# Altium schematic sheet MOTORS.SchDoc
size A; SheetNumber: 6; SheetTotal: 12
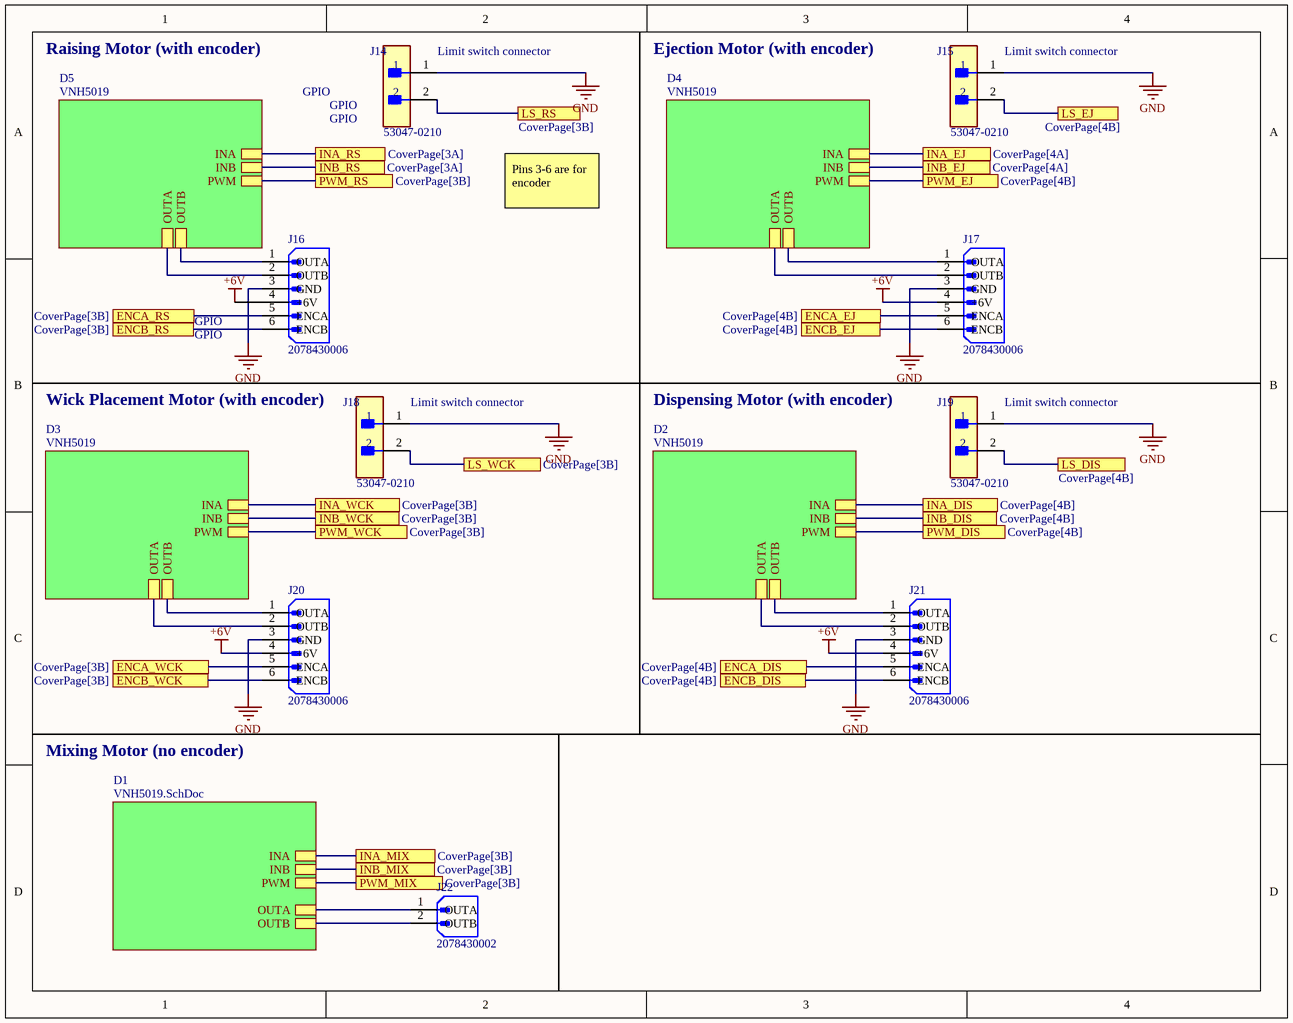
[diagram p0: MOTORS.SchDoc]

## Parts
J14  53047-0210  [FP-53047-0210-MFG]
J15  53047-0210  [FP-53047-0210-MFG]
J16  2078430006  [MOLEX_2078430006]
J17  2078430006  [MOLEX_2078430006]
J18  53047-0210  [FP-53047-0210-MFG]
J19  53047-0210  [FP-53047-0210-MFG]
J20  2078430006  [MOLEX_2078430006]
J21  2078430006  [MOLEX_2078430006]
J22  2078430002  [MOLEX_2078430002]

## Sub-sheets
D1 = VNH5019.SchDoc: INB, PWM, INA, OUTA, OUTB
D2 = VNH5019: INB, PWM, INA, OUTA, OUTB
D3 = VNH5019: INB, PWM, INA, OUTA, OUTB
D4 = VNH5019: INB, PWM, INA, OUTA, OUTB
D5 = VNH5019: OUTA, OUTB, PWM, INA, INB

## Ports
ENCA_DIS (see CoverPage[4B]), ENCA_EJ (see CoverPage[4B]), ENCA_RS (see CoverPage[3B]), ENCA_WCK (see CoverPage[3B]), ENCB_DIS (see CoverPage[4B]), ENCB_EJ (see CoverPage[4B]), ENCB_RS (see CoverPage[3B]), ENCB_WCK (see CoverPage[3B]), INA_DIS (see CoverPage[4B]), INA_EJ (see CoverPage[4A]), INA_MIX (see CoverPage[3B]), INA_RS (see CoverPage[3A]), INA_WCK (see CoverPage[3B]), INB_DIS (see CoverPage[4B]), INB_EJ (see CoverPage[4A]), INB_MIX (see CoverPage[3B]), INB_RS (see CoverPage[3A]), INB_WCK (see CoverPage[3B]), LS_DIS (see CoverPage[4B]), LS_EJ (see CoverPage[4B]), LS_RS (see CoverPage[3B]), LS_WCK (see CoverPage[3B]), PWM_DIS (see CoverPage[4B]), PWM_EJ (see CoverPage[4B]), PWM_MIX (see CoverPage[3B]), PWM_RS (see CoverPage[3B]), PWM_WCK (see CoverPage[3B])

## Nets
+6V: J16.4(+6V) J17.4(+6V) J20.4(+6V) J21.4(+6V)
GND: J14.1 J15.1 J16.3(GND) J17.3(GND) J18.1 J19.1 J20.3(GND) J21.3(GND)
ENCA_DIS: J21.5(ENCA) ; port ENCA_DIS
ENCA_EJ: J17.5(ENCA) ; port ENCA_EJ
ENCA_RS: J16.5(ENCA) ; port ENCA_RS
ENCA_WCK: J20.5(ENCA) ; port ENCA_WCK
ENCB_DIS: J21.6(ENCB) ; port ENCB_DIS
ENCB_EJ: J17.6(ENCB) ; port ENCB_EJ
ENCB_RS: J16.6(ENCB) ; port ENCB_RS
ENCB_WCK: J20.6(ENCB) ; port ENCB_WCK
INA_DIS: port INA_DIS, sheet D2/INA
INA_EJ: port INA_EJ, sheet D4/INA
INA_MIX: port INA_MIX, sheet D1/INA
INA_RS: port INA_RS, sheet D5/INA
INA_WCK: port INA_WCK, sheet D3/INA
INB_DIS: port INB_DIS, sheet D2/INB
INB_EJ: port INB_EJ, sheet D4/INB
INB_MIX: port INB_MIX, sheet D1/INB
INB_RS: port INB_RS, sheet D5/INB
INB_WCK: port INB_WCK, sheet D3/INB
LS_DIS: J19.2 ; port LS_DIS
LS_EJ: J15.2 ; port LS_EJ
LS_RS: J14.2 ; port LS_RS
LS_WCK: J18.2 ; port LS_WCK
PWM_DIS: port PWM_DIS, sheet D2/PWM
PWM_EJ: port PWM_EJ, sheet D4/PWM
PWM_MIX: port PWM_MIX, sheet D1/PWM
PWM_RS: port PWM_RS, sheet D5/PWM
PWM_WCK: port PWM_WCK, sheet D3/PWM
NetJ16_1: J16.1(OUTA) ; sheet D5/OUTB
NetJ16_2: J16.2(OUTB) ; sheet D5/OUTA
NetJ17_1: J17.1(OUTA) ; sheet D4/OUTB
NetJ17_2: J17.2(OUTB) ; sheet D4/OUTA
NetJ20_1: J20.1(OUTA) ; sheet D3/OUTB
NetJ20_2: J20.2(OUTB) ; sheet D3/OUTA
NetJ21_1: J21.1(OUTA) ; sheet D2/OUTB
NetJ21_2: J21.2(OUTB) ; sheet D2/OUTA
NetJ22_1: J22.1(OUTA) ; sheet D1/OUTA
NetJ22_2: J22.2(OUTB) ; sheet D1/OUTB

## Notes on the sheet
- Raising Motor (with encoder)
- GPIO
- (near J14) Limit switch connector
- Ejection Motor (with encoder)
- (near J15) Limit switch connector
- Pins 3-6 are for encoder
- Wick Placement Motor (with encoder)
- (near J18) Limit switch connector
- Dispensing Motor (with encoder)
- (near J19) Limit switch connector
- Mixing Motor (no encoder)

## Library data of the parts
J14 J15 J18 J19 = CMP-2000-05628-3: CONN HEADER VERT 2POS 1.25MM; Manufacturer: Molex; Conn Gender: Male; Voltage Rating: 125V; Conn Orientation: Vertical; Number Of Contacts: 2; Current Rating: 1A; Contact Material: Tin; Temperature Range Low: -40°C; ComponentLink2URL: http://www.molex.com/webdocs/datasheets/pdf/en-us/0530470210_PCB_HEADERS.pdf; Mouser Description: 1.25mm Pitch PicoBlade™ Wire-to-Board Header, Vertical, with Friction Lock, 2 Circuits; Manufacturer Part Number: 53047-0210; Temperature Range High: +85°C; ComponentLink2Description: Datasheet; Automotive: No; RoHS: TRUE; Ambient Temperature Range High: +85°C; Octopart: https://octopart.com/53047-0210-molex-276772; Footprint Url: https://www.molex.com/pdm_docs/sd/530470210_sd.pdf; Lead Free: Yes; Pitch: 1.25mm; Temperature: -40°C to +85°C; Device Class L2: Headers and Wire Housings; Package: 0; Ambient Temperature Range Low: -40°C; Digikey Description: CONN HEADER VERT 2POS 1.25MM; Category: Conn; Device Class L3: unset; Number Of Rows: 1; Device Class L1: Connectors; Height: 4.4mm
J16 J17 J20 J21 = CMP-116-000000-1: Availability: Unavailable; Price: None; Value: *; Pin Count: 6; MP: 2078430006; Component Type: Standard; Design Item ID: 2078430006; Package: None; Source: 2078430006.SchLib
J22 = CMP-002-00086-1: Conn Wire to Board HDR 6 POS 2.5mm Solder ST Top Entry Thru-Hole Bag; MF: Molex; Pins: 2; SnapEDA_Link: https://www.snapeda.com/parts/2078430002/Molex/view-part/?ref=snap; Component Type: Standard; Case/Package: None; Price: None; MP: 2078430002; Source: 2078430002.SchLib; Design Item ID: 2078430002; Availability: In Stock; Purchase-URL: https://pricing.snapeda.com/search/part/2078430002/?ref=eda; Value: *; Check_prices: https://www.snapeda.com/parts/2078430002/Molex/view-part/?ref=eda